# EasyEDA Pro project Striso_USB_hub.epro

# Schematic sch_usb 2.0（type c version）
Board Name: 02-Type C version; Create Date: 2024-06-10; Page Name: P1; Project Name: USB hub SL2.1A; Schematic Name: sch_usb 2.0（type c version）; Update Date: 2024-08-19; Company: Striso; Drawn: pierstitus; Page Size: A5; Part Number: JLCPCB-001; Reviewed: EasyEDA; Version: V0.1
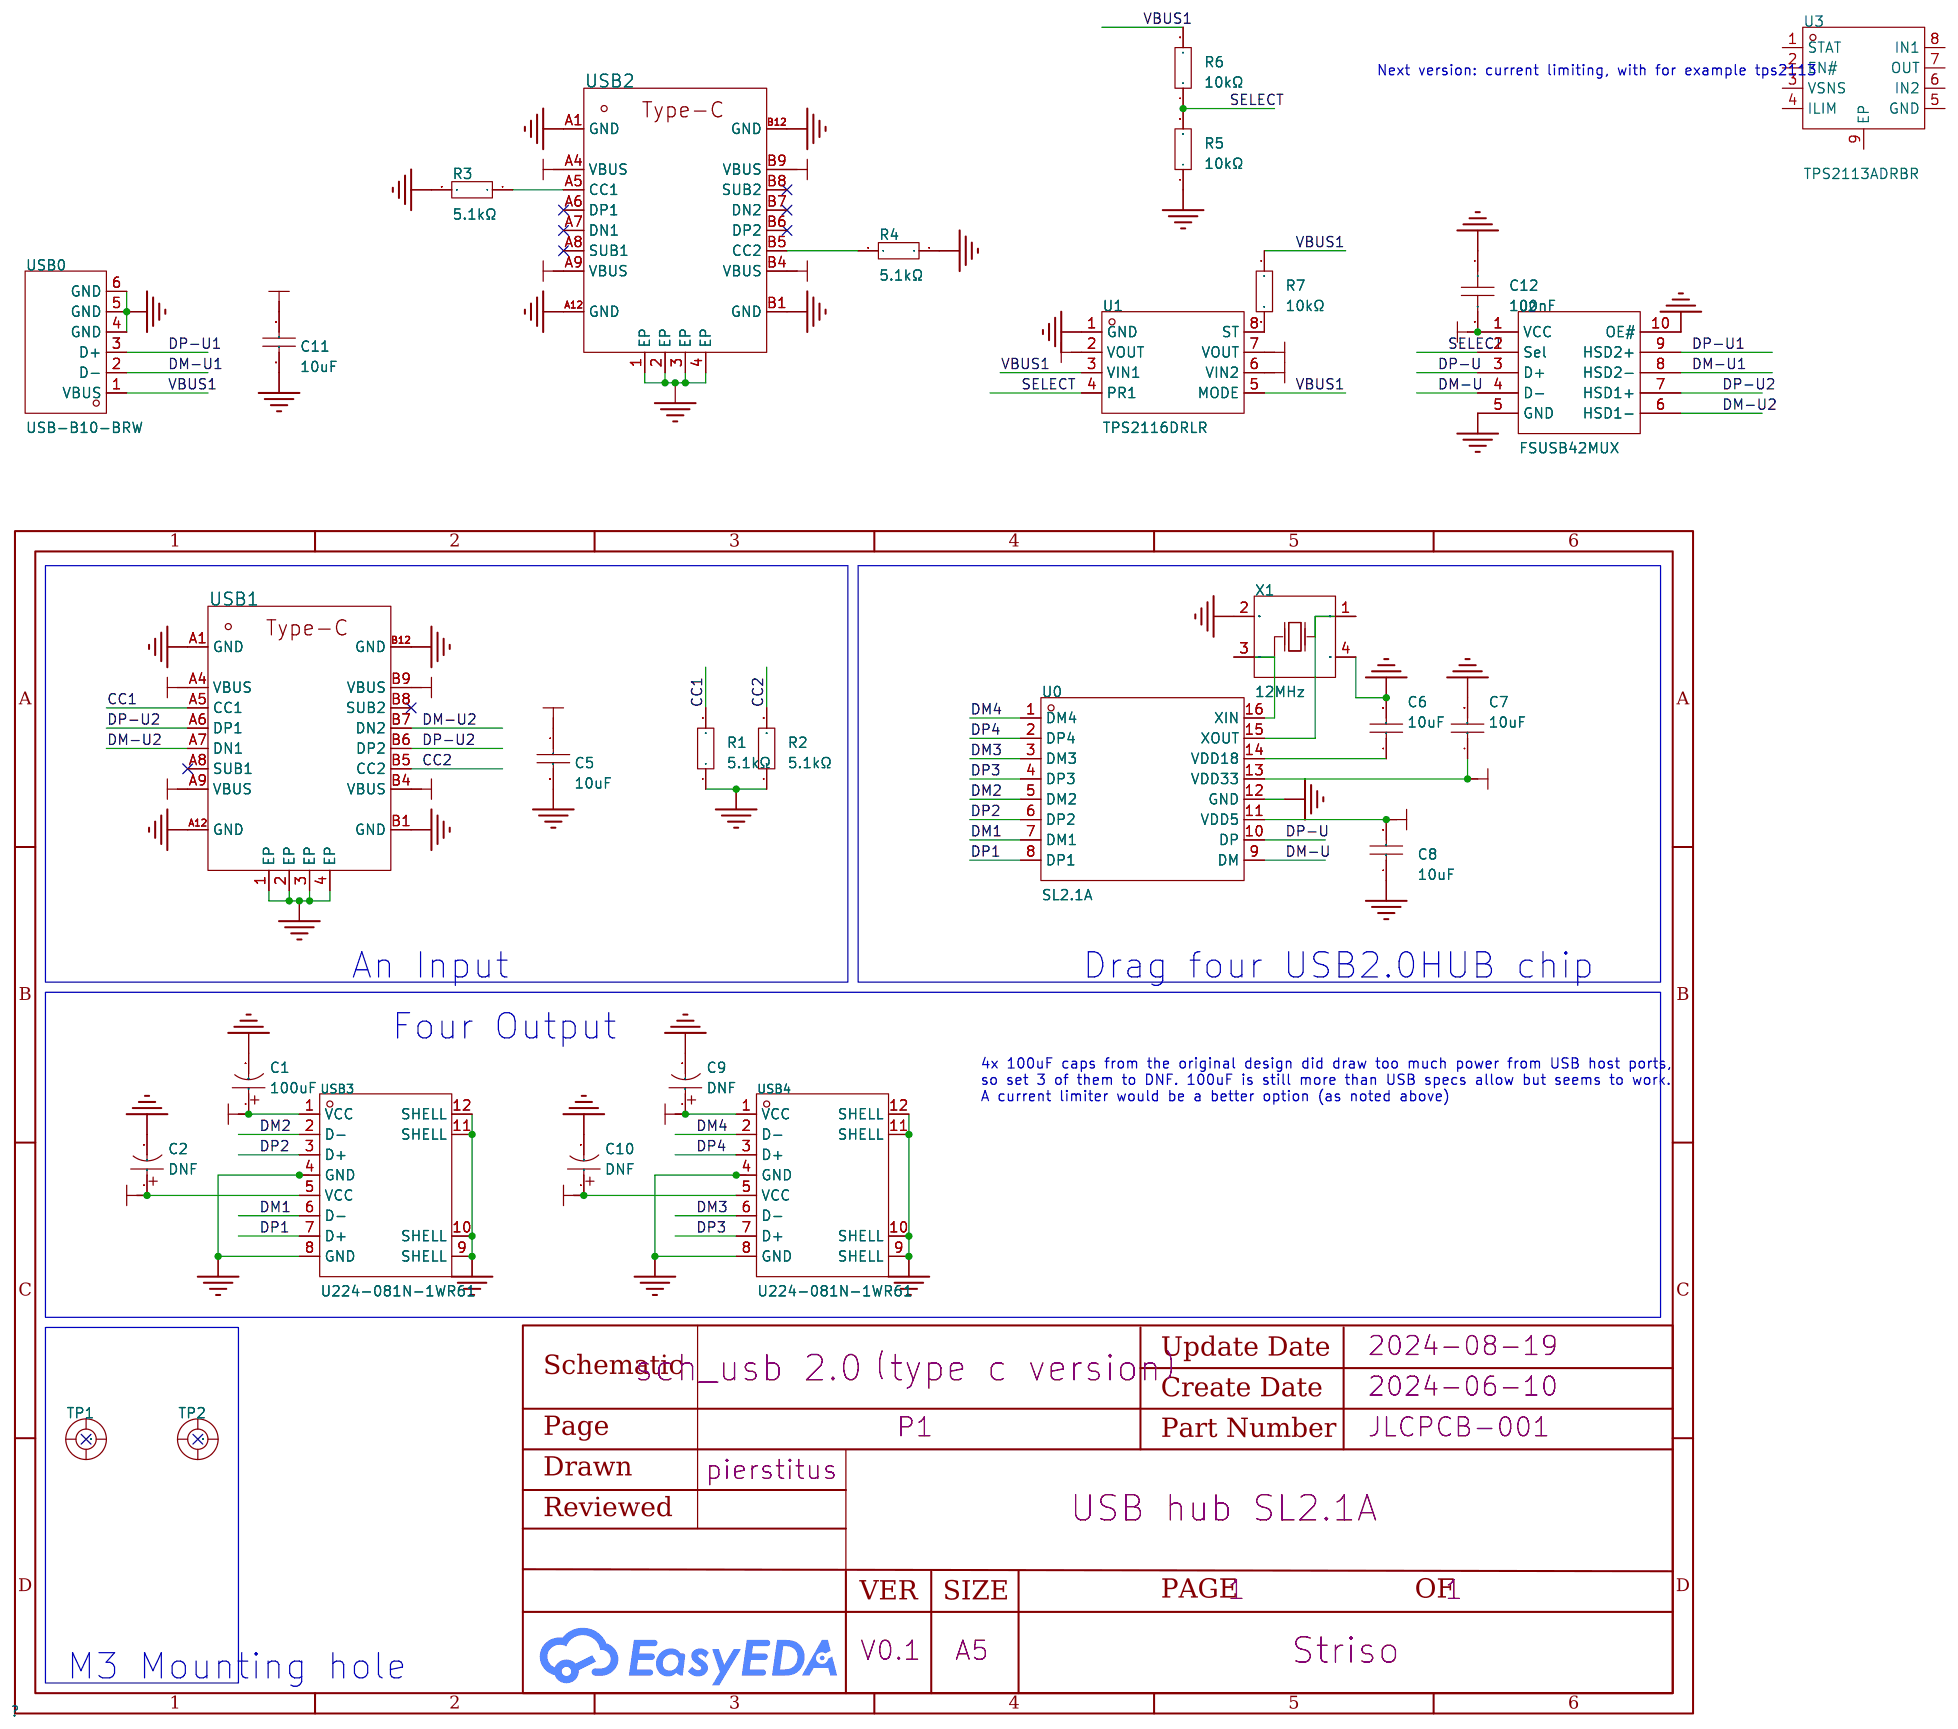
[diagram p0: schematic sheet]

## Parts
C1  100uF  [CAP-SMD_BD6.3-L6.6-W6.6-FD]
C2  DNF  [CAP-SMD_BD6.3-L6.6-W6.6-FD]
C5  10uF  [C0805]
C6  10uF  [C0805]
C7  10uF  [C0805]
C8  10uF  [C0805]
C9  DNF  [CAP-SMD_BD6.3-L6.6-W6.6-FD]
C10  DNF  [CAP-SMD_BD6.3-L6.6-W6.6-FD]
C11  10uF  [C0805]
C12  100nF  [C0603]
R1  5.1kΩ  [R0603]
R2  5.1kΩ  [R0603]
R3  5.1kΩ  [R0603]
R4  5.1kΩ  [R0603]
R5  10kΩ  [R0603]
R6  10kΩ  [R0603]
R7  10kΩ  [R0603]
TP1  -  [M3]
TP2  -  [M3]
U0  SL2.1A  [SOP-16_L10.0-W3.9-P1.27-LS6.0-BL]
U1  TPS2116DRLR  [SOT-583-8_L2.1-W1.6-P0.50-LS1.6-BL]
U2  FSUSB42MUX  [MSOP-10_L3.0-W3.0-P0.50-LS5.0-BL]
U3  TPS2113ADRBR  [SON-8_L3.0-W3.0-P0.65-LS3.0-BL-EP]
USB0  USB-B10-BRW  [USB-B-TH_USB-B10-BRW]
USB1  KH-TYPE-C-16P  [USB-C-SMD_KH-TYPE-C-16P]
USB2  KH-TYPE-C-16P  [USB-C-SMD_KH-TYPE-C-16P]
USB3  U224-081N-1WR61  [USB-A-TH_XKB_U224-08XN-1XR61]
USB4  U224-081N-1WR61  [USB-A-TH_XKB_U224-08XN-1XR61]
X1  12MHz  [OSC-SMD_4P-L3.2-W2.5-BL]

## Library data of the parts
C1 = UWX1C101MCL1GB: 容值:100uF;精度:±20%;额定电压:16V;纹波电流:129mA@10kHz;等效串联电阻:-;; LCSC Part Name: 100uF ±20% 16V; Supplier Part: C37308; Manufacturer: Nichicon(尼吉康); Supplier Footprint: SMD,D6.3xL5.5mm; JLCPCB Part Class: 扩展库; Datasheet: https://atta.szlcsc.com/upload/public/pdf/source/20170511/1494500117526.pdf; Supplier: LCSC; Tolerance: ±20%; Rated Voltage: 16V; φD: 6.3mm; L: 5.4mm; Ripple Current: 129mA@10kHz; Lifetime @ Temp: 2000hrs@85℃; Operating Temperature: -40℃~+85℃
C2 C9 C10 = UWX1C101MCL1GB: 容值:100uF;精度:±20%;额定电压:16V;纹波电流:129mA@10kHz;等效串联电阻:-;; LCSC Part Name: 100uF ±20% 16V; Supplier Part: C111600; Manufacturer: Nichicon(尼吉康); Supplier Footprint: SMD,D6.3xL5.5mm; JLCPCB Part Class: 扩展库; Datasheet: https://atta.szlcsc.com/upload/public/pdf/source/20170511/1494500117526.pdf; Supplier: LCSC; Tolerance: ±20%; Rated Voltage: 16V; φD: 6.3mm; L: 5.4mm; Ripple Current: 129mA@10kHz; Lifetime @ Temp: 2000hrs@85℃; Operating Temperature: -40℃~+85℃
C5-C8 C11 = CL21A106KAYNNNE_C15850: 容值:10uF;精度:±10%;额定电压:25V;材质(温度系数):X5R;; LCSC Part Name: 10uF ±10% 25V; Supplier Part: C15850; Manufacturer: SAMSUNG(三星); Manufacturer Part: CL21A106KAYNNNE; Supplier Footprint: 0805; Datasheet: https://atta.szlcsc.com/upload/public/pdf/source/20160103/1457707679302.pdf; Supplier: LCSC; Tolerance: ±10%; Voltage Rated: 25V; Temperature Coefficient: X5R
C12 = CAP_0603: Supplier Footprint: 0603
R1-R7 = Res_0603: Supplier Footprint: 0603
TP1 TP2 = M3: Manufacturer: Shuntian(顺天五金); Manufacturer Part: M3x10+6; Supplier Part: C551322; Supplier: LCSC; JLCPCB Part Class: 扩展库
U0 = SL2.1A: 应用功能:集线器;接口协议:-;; LCSC Part Name: SL2.1A USB2.0 HUB 控制器集成电路; Supplier Part: C192893; Manufacturer: CoreChips(和芯润德); Supplier Footprint: SOP-16; Datasheet: https://atta.szlcsc.com/upload/public/pdf/source/20180522/C192893_624110D24898D57AAC785E3DF98EA862.pdf; Supplier: LCSC; Applications Function: 集线器
U1 = TPS2116DRLR: Number of Outputs:1 Output Current:2.5A Input Voltage:1.6V~5.5V Input Voltage:1.6V~5.5V Resistor On-State:42mΩ Operating Temperature	-:-40℃~+105℃ Operating Temperature	-:-40℃~+105℃; Supplier Part: C3235557; Manufacturer: TI(德州仪器); Supplier Footprint: SOT-583; JLCPCB Part Class: Extended Part; Datasheet: https://www.ti.com/cn/lit/gpn/tps2116; Supplier: LCSC; Number of Outputs: 1; Output Current: 2.5A; Input Voltage: 1.6V~5.5V; Resistor On-State: 42mΩ; Operating Temperature	-: -40℃~+105℃
U2 = FSUSB42MUX: Supply Voltage:2.4V~4.4V Supply Voltage:2.4V~4.4V On-State Resistance (Max):6.5Ω; LCSC Part Name: 小功率，两端口，高速 USB2.0 (480Mbps) 开关; Supplier Part: C11355; Manufacturer: onsemi(安森美); Supplier Footprint: MSOP-10; JLCPCB Part Class: Extended Part; Datasheet: https://atta.szlcsc.com/upload/public/pdf/source/20130225/1457706594597.pdf; Supplier: LCSC; Supply Voltage: 2.4V~4.4V; On-State Resistance (Max): 6.5Ω
U3 = TPS2113ADRBR: Supply Voltage:2.8V~5.5V Supply Voltage:2.8V~5.5V Output Current:1.25A Operating Temperature:-40℃~+85℃ Operating Temperature:-40℃~+85℃; LCSC Part Name: Other Power Mgt, PFC; Supplier Part: C354512; Manufacturer: TI(德州仪器); Supplier Footprint: SON-8(3x3); JLCPCB Part Class: Extended Part; Datasheet: https://www.ti.com/cn/lit/gpn/tps2112a; Supplier: LCSC; Supply Voltage: 2.8V~5.5V; Output Current: 1.25A; Operating Temperature: -40℃~+85℃
USB0 = USB-B10-BRW: Connector Type:Type-B Standard:USB 2.0 Gender:Female Number of Ports:1 Number of Contacts:4P Mounting Style:Right-Angle Current Rating - Power (Max):1.5A Operating Temperature Range:-20℃~+70℃ Operating Temperature Range:-20℃~+70℃ Soldering Temperature(Max; LCSC Part Name: Type-B 母 弯插; Supplier Part: C720549; Manufacturer: XUNPU(讯普); Supplier Footprint: 插件; JLCPCB Part Class: Extended Part; Datasheet: https://atta.szlcsc.com/upload/public/pdf/source/20200812/C720549_53E9294752E2933874870440E626C579.pdf; Supplier: LCSC; Connector Type: Type-B; Standard: USB 2.0; Gender: Female; Number of Ports: 1; Number of Contacts: 4P; Mounting Style: Right-Angle; Current Rating - Power (Max): 1.5A; Operating Temperature Range: -20℃~+70℃; Soldering Temperature(Max): 260℃
USB1 USB2 = KH-TYPE-C-16P: Type-C母座 16PIN 立式四角贴板无压片; Supplier: LCSC; Supplier Part: C709357; Manufacturer: kinghelm(金航标); LCSC Part Name: Type-C母座
USB3 USB4 = U224-081N-1WR61: Connector Type:Type-A Standard:USB 2.0 Gender:Female Number of Ports:1 Number of Contacts:8P Mounting Style:Right-Angle Current Rating - Power (Max):1.5A Contact Material:Brass Contact Plating:Gold Operating Temperature Range:-40℃~+85℃ Operating Temperatu; LCSC Part Name: Type-A 母 弯插; Supplier Part: C2880657; Manufacturer: XKB Connectivity(中国星坤); Supplier Footprint: 插件; JLCPCB Part Class: Extended Part; Datasheet: https://atta.szlcsc.com/upload/public/pdf/source/20211011/F494ADC5FD1E44F95AF51E6AD715C4B9.pdf; Supplier: LCSC; Connector Type: Type-A; Standard: USB 2.0; Gender: Female; Number of Ports: 1; Number of Contacts: 8P; Mounting Style: Right-Angle; Current Rating - Power (Max): 1.5A; Contact Material: Brass; Contact Plating: Gold; Operating Temperature Range: -40℃~+85℃; Soldering Temperature(Max): 235℃
X1 = X322512MSB4SI: Crystal Type:贴片晶振 Frequency: Normal temperature Frequency Tolerance:±10ppm Normal temperature Frequency Tolerance:±10ppm External load capacitor: Frequency Stability(Full temperature range):±20ppm Frequency Stability(Full temperature range):±20ppm Operati; LCSC Part Name: 12MHz ±10ppm 20pF; Supplier Part: C9002; Manufacturer: YXC(扬兴晶振); Supplier Footprint: SMD3225-4P; JLCPCB Part Class: Basic Part; Datasheet: https://atta.szlcsc.com/upload/public/pdf/source/20240329/19D5F850207469550BEB00D7DFEDBC7A.pdf; Supplier: LCSC; Crystal Type: 贴片晶振; Normal temperature Frequency Tolerance: ±10ppm; Frequency Stability(Full temperature range): ±20ppm

## Nets
3.3V: C7.1 C12.2 U0.13(VDD33) U2.1(VCC)
GND: C1.2 C2.2 C5.2 C6.2 C7.2 C8.1 C9.2 C10.2 C11.2 C12.1 R1.1 R2.1 R3.2 R4.1 R5.1 U0.12(GND) U1.1(GND) U2.5(GND) U2.10(OE#) USB0.4(GND) USB0.5(GND) USB0.6(GND) USB1.1(EP) USB1.2(EP) USB1.3(EP) USB1.4(EP) USB1.A1(GND) USB1.A12(GND) USB1.B1(GND) USB1.B12(GND) USB2.1(EP) USB2.2(EP) USB2.3(EP) USB2.4(EP) USB2.A1(GND) USB2.A12(GND) USB2.B1(GND) USB2.B12(GND) USB3.4(GND) USB3.8(GND) USB3.9(SHELL) USB3.10(SHELL) USB3.11(SHELL) USB3.12(SHELL) USB4.4(GND) USB4.8(GND) USB4.9(SHELL) USB4.10(SHELL) USB4.11(SHELL) USB4.12(SHELL) X1.2(GND) X1.4(GND)
VBUS: C1.1 C2.1 C8.2 C9.1 C10.1 U0.11(VDD5) U1.2(VOUT) U1.7(VOUT) USB2.A4(VBUS) USB2.A9(VBUS) USB2.B4(VBUS) USB2.B9(VBUS) USB3.1(VCC) USB3.5(VCC) USB4.1(VCC) USB4.5(VCC)
VBUS1: C11.1 R6.2 R7.1 U1.3(VIN1) U1.5(MODE) USB0.1(VBUS)
VBUS2: C5.1 U1.6(VIN2) USB1.A4(VBUS) USB1.A9(VBUS) USB1.B4(VBUS) USB1.B9(VBUS)
CC1: R1.2 USB1.A5(CC1)
CC2: R2.2 USB1.B5(CC2)
DM1: U0.7(DM1) USB3.6(D-)
DM2: U0.5(DM2) USB3.2(D-)
DM3: U0.3(DM3) USB4.6(D-)
DM4: U0.1(DM4) USB4.2(D-)
DM-U: U0.9(DM) U2.4(D-)
DM-U1: U2.8(HSD2-) USB0.2(D-)
DM-U2: U2.6(HSD1-) USB1.A7(DN1) USB1.B7(DN2)
DP1: U0.8(DP1) USB3.7(D+)
DP2: U0.6(DP2) USB3.3(D+)
DP3: U0.4(DP3) USB4.7(D+)
DP4: U0.2(DP4) USB4.3(D+)
DP-U: U0.10(DP) U2.3(D+)
DP-U1: U2.9(HSD2+) USB0.3(D+)
DP-U2: U2.7(HSD1+) USB1.A6(DP1) USB1.B6(DP2)
SELECT: R5.2 R6.1 U1.4(PR1) U2.2(Sel)
$1N2405: C6.1 U0.14(VDD18)
$1N3683: U0.16(XIN) X1.3(OSC2)
$1N12703: R3.1 USB2.A5(CC1)
$1N12903: R4.2 USB2.B5(CC2)
$1N15987: R7.2 U1.8(ST)
$1N16304: U0.15(XOUT) X1.1(OSC1)

Not connected (* = marked no-connect by the designer): TP1 0*; TP2 0*; U3 1(STAT) 2(EN#) 3(VSNS) 4(ILIM) 5(GND) 6(IN2) 7(OUT) 8(IN1) 9(EP); USB1 A8(SUB1)* B8(SUB2)*; USB2 A6(DP1)* A7(DN1)* A8(SUB1)* B6(DP2)* B7(DN2)* B8(SUB2)*

## Notes on the sheet
- Next version: current limiting, with for example tps2113
- An Input
- Drag four USB2.0HUB chip
- Four Output
- 4x 100uF caps from the original design did draw too much power from USB host ports,
  so set 3 of them to DNF. 100uF is still more than USB specs allow but seems to work.
  A current limiter would be a better option (as noted above)
- M3 Mounting hole

# Board PCB_USB 2.0（Type C version）
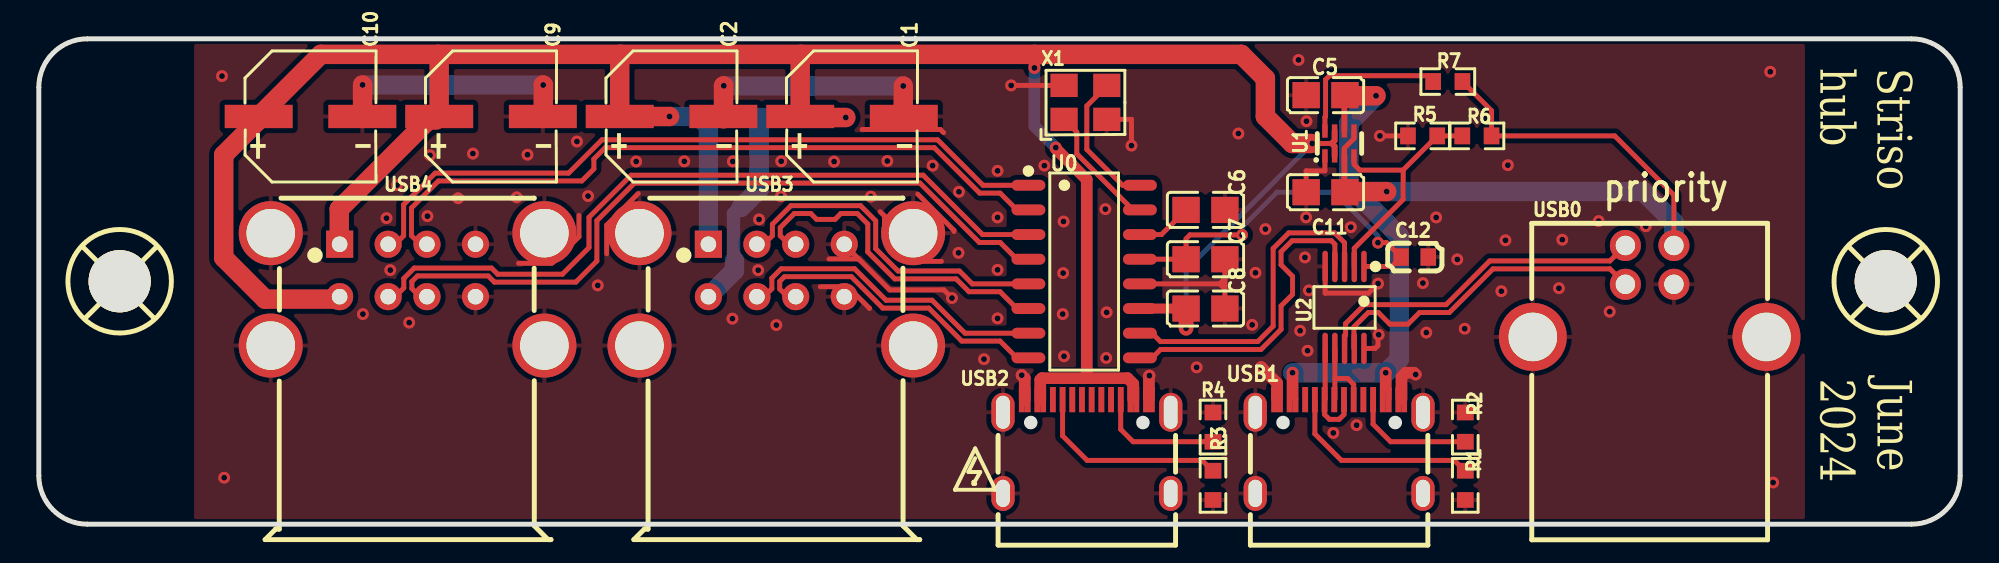
[diagram p1: board, top side]
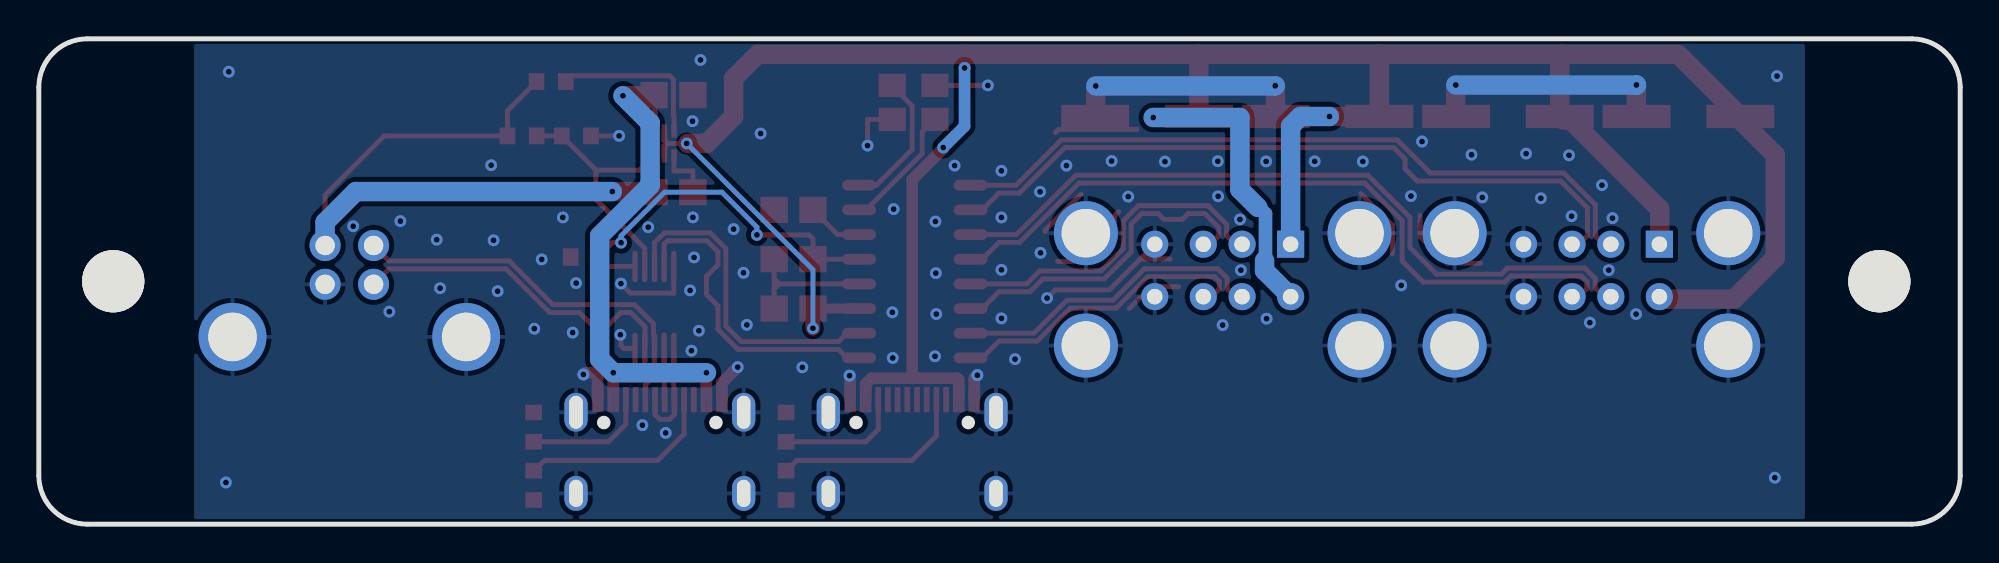
[diagram p2: board, bottom side, seen from below]

Outline 99 x 25 mm; copper layers: Top Layer, Bottom Layer. Coordinates in mm from the lower left corner of the outline.
Outline path: 0,22.5 0,2.5 arc(0.73,0.73) 2.5,0 96.5,0 arc(98.27,0.73) 99,2.5 99,22.5 arc(98.27,24.27) 96.5,25 2.5,25 arc(0.73,24.27) 0,22.5
Stack: Top Layer 0.035mm - / Dielectric1 1.51mm FR4 er 4.5 / Bottom Layer 0.035mm -

## Design rules (mm)
net DM4: OUTPUT4
net DP4: OUTPUT4
net DM1: OUTPUT1
net DP1: OUTPUT1
net DM2: OUTPUT2
net DP2: OUTPUT2
net DM3: OUTPUT3
net DP3: OUTPUT3
net DP-U: DP3
net DM-U: DP3
net DM-U2: DP1
net DP-U2: DP1
net DP-U1: DP2
net DM-U1: DP2
template: 自定义配置
spacing copperThickness1oz (default): track to track 0.152, other pairs 0.152 to 0.3
spacing copperThickness2oz: track to track 0.203, other pairs 0.152 to 0.3
track width copperThickness1oz (default): min 0.127, default 0.254, max 2.54
track width copperThickness2oz: min 0.203, default 0.254, max 2.54
differential pair differentialPair (default): width min 0.127, default 0.254, max 2.54; gap min 0.152, default 0.152
via viaSize (default): diameter min 0.5, default 0.61, max 10; hole min 0.3, default 0.305, max 6.299

## Placement (name value [footprint] x y rotation side)
C1  100uF  [CAP-SMD_BD6.3-L6.6-W6.6-FD]  41.9 21 0 top
C2  DNF  [CAP-SMD_BD6.3-L6.6-W6.6-FD]  32.6 21 0 top
C5  10uF  [C0805]  66.3 22.1 180 top
C6  10uF  [C0805]  60.11 16.19 0 top
C7  10uF  [C0805]  60.11 13.65 0 top
C8  10uF  [C0805]  60.11 11.11 180 top
C9  DNF  [CAP-SMD_BD6.3-L6.6-W6.6-FD]  23.3 21 0 top
C10  DNF  [CAP-SMD_BD6.3-L6.6-W6.6-FD]  14 21 0 top
C11  10uF  [C0805]  66.3 17.1 180 top
C12  100nF  [C0603]  70.89 13.76 180 top
R1  5.1kΩ  [R0603]  73.5 2 90 top
R2  5.1kΩ  [R0603]  73.5 5 270 top
R3  5.1kΩ  [R0603]  60.5 2 270 top
R4  5.1kΩ  [R0603]  60.5 5 270 top
R5  10kΩ  [R0603]  71.3 20 0 top
R6  10kΩ  [R0603]  74.1 20 0 top
R7  10kΩ  [R0603]  72.6 22.8 180 top
TP1  -  [M3]  4 12.5 0 top
TP2  -  [M3]  95 12.5 0 top
U0  SL2.1A  [SOP-16_L10.0-W3.9-P1.27-LS6.0-BL]  53.86 13.01 270 top
U1  TPS2116DRLR  [SOT-583-8_L2.1-W1.6-P0.50-LS1.6-BL]  67.02 19.61 0 top
U2  FSUSB42MUX  [MSOP-10_L3.0-W3.0-P0.50-LS5.0-BL]  67.28 11.16 180 top
USB0  USB-B10-BRW  [USB-B-TH_USB-B10-BRW]  83 12 0 top
USB1  KH-TYPE-C-16P  [USB-C-SMD_KH-TYPE-C-16P]  67 4 0 top
USB2  KH-TYPE-C-16P  [USB-C-SMD_KH-TYPE-C-16P]  54 4 0 top
USB3  U224-081N-1WR61  [USB-A-TH_XKB_U224-08XN-1XR61]  38 12.09 0 top
USB4  U224-081N-1WR61  [USB-A-TH_XKB_U224-08XN-1XR61]  19 12.09 0 top
X1  12MHz  [OSC-SMD_4P-L3.2-W2.5-BL]  53.93 21.73 0 top

## Footprints (pads in the part's own frame, mm; a bottom-side part is the same pattern mirrored in y, then rotated)
C0603
  rect 0.8x0.9 smd: 1(-0.7,0) 2(0.7,0)
C0805
  rect 1.41x1.35 smd: 1(-1,0) 2(1,0)
CAP-SMD_BD6.3-L6.6-W6.6-FD
  rect 3.5x1.2 smd: 1(-2.67,0) 2(2.67,0)
M3
  round 3.2 hole 3.2: 0(0.165,0.013)
MSOP-10_L3.0-W3.0-P0.50-LS5.0-BL
  oval 0.28x1.62 smd: 1(-1,-2.11) 2(-0.5,-2.11) 3(0,-2.11) 4(0.5,-2.11) 5(1,-2.11) 6(1,2.11) 7(0.5,2.11) 8(0,2.11) 9(-0.5,2.11) 10(-1,2.11)
OSC-SMD_4P-L3.2-W2.5-BL
  rect 1.4x1.2 smd: 1(-1.1,-0.875) 2(1.1,-0.875) 3(1.1,0.875) 4(-1.1,0.875)
R0603
  rect 0.806x0.864 smd: 1(-0.753,0) 2(0.753,0)
SOP-16_L10.0-W3.9-P1.27-LS6.0-BL
  oval 0.56x1.745 smd: 1(-4.445,-2.873) 2(-3.175,-2.873) 3(-1.905,-2.873) 4(-0.635,-2.873) 5(0.635,-2.873) 6(1.905,-2.873) 7(3.175,-2.873) 8(4.445,-2.873) 9(4.445,2.873) 10(3.175,2.873) 11(1.905,2.873) 12(0.635,2.873) 13(-0.635,2.873) 14(-1.905,2.873) 15(-3.175,2.873) 16(-4.445,2.873)
SOT-583-8_L2.1-W1.6-P0.50-LS1.6-BL
  rect 0.28x0.68 smd: 1(-0.75,-0.64) 2(-0.25,-0.64) 3(0.25,-0.64) 4(0.75,-0.64) 5(0.75,0.64) 6(0.25,0.64) 7(-0.25,0.64) 8(-0.75,0.64)
USB-A-TH_XKB_U224-08XN-1XR61
  rect 1.4x1.4 hole 0.8: 1(-3.5,2.325)
  round 1.4 hole 0.8: 2(-1,2.325) 3(1,2.325) 4(3.5,2.325) 5(-3.5,-0.375) 6(-1,-0.375) 7(1,-0.375) 8(3.5,-0.375)
  round 3.3 hole 2.5: 9(-7.05,2.895) 10(-7.05,-2.895) 11(7.05,2.895) 12(7.05,-2.895)
USB-B-TH_USB-B10-BRW
  round 1.6 hole 1: 1(1.25,2.355) 2(-1.25,2.355) 3(-1.25,0.355) 4(1.25,0.355)
  round 3.5 hole 2.5: 5(-6.02,-2.355) 6(6.02,-2.355)
USB-C-SMD_KH-TYPE-C-16P
  oval 1.2x2 hole 0.7x1.7: 1(-4.32,1.765) 2(4.32,1.765)
  oval 1.2x1.8 hole 0.7x1.4: 3(-4.32,-2.415) 4(4.32,-2.415)
  rect 0.3x1.3 smd: A1(-3.35,2.415) A4(-2.55,2.415) A5(-1.25,2.415) A6(-0.25,2.415) A7(0.25,2.415) A8(1.25,2.415) A9(2.55,2.415) A12(3.35,2.415) B1(3.05,2.415) B4(2.25,2.415) B5(1.75,2.415) B6(0.75,2.415) B7(-0.75,2.415) B8(-1.75,2.415) B9(-2.25,2.415) B12(-3.05,2.415)

## Nets
As in the schematic.

Pads without a net: TP1 0; TP2 0; USB1 A8 B8; USB2 A6 A7 A8 B6 B7 B8

## Via types
v1: diameter 0.61, hole 0.305, Top Layer to Bottom Layer, 100 vias

## Routing (per net, layer and track width the routed paths; a pad name or vN(x,y) marks a point on that pad's centre or on a via; arc(x,y) is an arc through that point)
3.3V: length 19.4
  Top Layer w0.254: v1(62,14.9) 59.31,14.9 59.11,14.7 C7.1 U0.13 ; U2.1 69.71,13.27 C12.2 69.45,14.5 v1(69,14.5)
  Bottom Layer w0.254: v1(62,14.9) 62,15.3 63.8,17.1 66.75,17.1 69,14.85 v1(69,14.5)
GND: length 83.4
  Top Layer w0.254: 61.11,12.65 61.11,12.11 ; 61.11,12.65 60.84,12.38 ; 61.11,12.65 C7.2 ; 61.11,12.11 60.84,12.38 ; 61.11,12.11 C8.1 ; v1(56.3,19.5) 56.3,20.85 X1.2 ; 46.51,13.54 45.35,13.54 45.33,13.51 ; 26.59,13.61 26.42,13.44 24.72,13.44 ; 41.5,14.4 43.84,12.07 46.63,12.07 v1(47.05,11.65) ; U1.1 66.27,18.2 65.3,18.2 C11.2 ; 45.29,17 47.15,15.14 47.15,15.07 ; 46.62,20.17 46.45,20.33 42.42,20.33 ; 60.84,12.38 U0.12 ; 30.89,17.03 29.26,15.41 29.26,13.93 ; 40.71,13.66 42.19,13.66 ; 40.27,12.23 41.69,12.23 41.7,12.24 ; v1(69.04,9.76) 69,9.72 69,9.2 68.85,9.05 U2.10 ; 26.51,13.48 27.83,14.81 27.83,15.9 ; U2.5 66.28,11.9 68.51,11.9 v1(69.01,12.39) ; 41.8,12.12 42.8,11.12 42.8,11.12 ; 43.58,15.05 43.58,15.87 43.35,16.1 ; R5.1 v1(69.1,20) ; v1(50.1,22.6) X1.4
  Top Layer w0.6: v1(57.22,7.65) 57.2,7.62 57.2,6.44 ; 50.8,6.4 50.8,7.52 v1(50.64,7.67) ; v1(70.94,7.71) 70.85,7.8 70.42,7.8 70.21,7.59 70.21,6.44 ; v1(62.99,8.09) 63.8,7.27 63.8,6.45
  Top Layer w1: 16.66,21.02 16.68,21.05 v1(16.68,22.63) ; 25.99,21 25.99,22.61 v1(25.99,22.62) ; v1(44.54,22.57) 44.54,21.02 44.56,21 ; v1(35.29,22.58) 35.28,22.57 35.28,20.88
  Bottom Layer w0.6: v1(57.22,7.65) 57.22,7.66 ; v1(70.94,7.71) 70.93,7.71 ; v1(50.64,7.67) 50.63,7.68
  Bottom Layer w1: v1(25.99,22.62) 16.69,22.62 16.68,22.61 v1(16.68,22.63) ; v1(35.29,22.58) 35.3,22.57 v1(44.54,22.57)
  vias: v1(9.44,23.08) v1(9.55,2.39) v1(16.7,10.82) v1(17.92,15.76) v1(18.11,13.09) v1(18.46,17.46) v1(19.08,10.38) v1(20.02,15.87) v1(20.16,19) v1(21.61,16.79) v1(22.37,19.09) v1(24.62,16.83) v1(25.18,19.03) v1(27.73,19.71) v1(28.3,16.9) v1(28.8,12.3) v1(30.78,18.68) v1(33.26,18.69) v1(35.74,10.59) v1(35.76,18.69) v1(37.11,15.7) v1(37.06,13.08) v1(38,10.26) v1(38.24,16.89) v1(38.25,18.7) v1(40.98,18.68) v1(42.87,16.87) v1(43.72,18.71) v1(46.05,18.47) v1(47.41,17.12) v1(47.39,13.98) v1(48.7,8.5) v1(49.4,18.2) v1(49.4,15.8) v1(49.4,13.1) v1(49.4,10.6) v1(51.81,18.47) v1(52.8,15.59) v1(52.78,12.93) v1(52.76,10.82) v1(52.82,8.65) v1(54.95,16.23) v1(55.02,10.91) v1(55,8.56) v1(59.66,8.08) v1(61.81,20.12) v1(62.52,10.27) v1(62.69,12.95) v1(63.2,15.2) v1(64.91,23.91) v1(64.99,9.96) v1(65.24,13.74) v1(65.32,20.76) v1(65.3,15.8) v1(65.44,12.04) v1(65.37,8.93) v1(66.7,4.7) v1(67.6,15.3) v1(67.9,5.1) v1(71.32,12.42) v1(71.49,9.87) v1(72,15.8) v1(73.09,13.64) v1(73.47,10.07) v1(75.36,12) v1(75.57,14.62) v1(75.69,18.49) v1(78.32,12.15) v1(78.5,14.65) v1(80.37,15.61) v1(80.94,10.95) v1(82.8,15.35) v1(89.21,23.3) v1(89.36,2.15)
VBUS: length 162.6
  Top Layer w0.254: 66.62,19.61 v1(65.62,19.61)
  Top Layer w0.3: U1.7 66.77,19.76 66.62,19.61 66.77,19.46 U1.2
  Top Layer w0.508: U0.11 C8.2
  Top Layer w0.6: v1(52.4,19.4) 52.4,19.34 54,17.75 54,7.52 ; 54,7.52 51.69,7.52 51.6,7.43 51.6,6.41 ; 54,7.52 56.1,7.52 56.39,7.23 56.39,6.41 ; 51.3,24.2 v1(51.3,23.5)
  Top Layer w0.762: v1(59.11,10.09) C8.2
  Top Layer w1: v1(32.5,21) C2.1 29.93,24.16 29.97,24.2 ; 15.44,11.59 11.66,11.59 9.53,13.72 9.53,19.02 11.44,20.93 ; v1(41.58,20.95) 39.28,20.95 39.22,21 ; 20.57,24.2 20.63,24.14 C9.1 ; 20.57,24.2 29.97,24.2 ; 20.57,24.2 14.53,24.2 C10.1 ; C1.1 39.23,24.16 39.27,24.2 ; 65.55,19.61 64.59,19.61 63.2,21 63.2,22.96 61.96,24.2 39.27,24.2 ; 29.97,24.2 39.27,24.2 ; 20.47,20.82 20.07,20.82 15.48,16.23 15.48,14.3
  Bottom Layer w0.254: v1(59.11,10.09) 59.11,13.11 v1(65.62,19.61)
  Bottom Layer w0.6: v1(51.3,23.5) 51.3,20.5 v1(52.4,19.4)
  Bottom Layer w0.7: 35.84,13.58 35.8,13.62 35.8,15.99 36.12,16.32 36.19,16.32
  Bottom Layer w1: USB3.5 35.84,13.06 35.84,13.58 ; 36.19,16.32 37.11,17.24 37.11,20.95 v1(41.58,20.95) ; USB3.1 34.5,20.5 34,21 v1(32.5,21)
VBUS1: length 38.9
  Top Layer w0.254: USB0.1 84.25,16.95 81.2,20 R6.2 74.85,21.3 R7.1 ; U1.5 67.77,19.87 67.27,19.37 U1.3
  Top Layer w0.3: U1.3 67.27,17.13 C11.1
  Top Layer w1: v1(69.45,17.13) 67.27,17.13
  Bottom Layer w1: v1(69.45,17.13) 82.67,17.13 84.25,15.55 USB0.1
VBUS2: length 27.4
  Top Layer w0.3: U1.6 67.27,22.07 C5.1 ; 69.4,7.1 69.55,6.95 USB1.A9 ; USB1.B9 64.6,6.56 64.6,7.1
  Top Layer w0.6: v1(69.4,7.8) 69.4,7.1 ; v1(64.6,7.8) 64.6,7.1
  Top Layer w1: 67.27,22.07 v1(68.9,22.07)
  Bottom Layer w1: v1(68.9,22.07) 67.5,20.67 67.5,17.45 70.1,14.85 70.1,8.5 v1(69.4,7.8) v1(64.6,7.8)
CC1: length 10.3
  Top Layer w0.254: USB1.A5 65.75,4.65 67.12,3.28 72.94,3.28 73.47,2.75 R1.2
CC2: length 6.4
  Top Layer w0.254: USB1.B5 68.75,5.15 69.65,4.25 R2.2
DM1: length 16.3
  Top Layer w0.254: USB3.6 37.36,11.72 37.77,12.13 37.77,12.67 38.25,13.15 42.03,13.15 43.65,11.54 46.03,11.54 47.72,9.84 U0.7
DM2: length 17.7
  Top Layer w0.254: USB3.2 37.36,14.42 37.8,14.86 37.8,15.45 38.75,16.41 42.34,16.41 43.12,15.63 43.12,14.19 44.27,13.04 47.44,13.04 48.1,12.38 U0.5
DM3: length 38.3
  Top Layer w0.254: USB4.6 18.36,11.72 18.81,12.17 18.81,12.65 19.34,13.19 23.33,13.19 23.64,12.88 26.98,12.88 28.35,14.25 28.35,15.81 30.52,17.98 45.57,17.98 48.63,14.92 U0.3
DM4: length 37.1
  Top Layer w0.254: USB4.2 18.36,14.42 18.8,14.86 18.8,16.46 20.42,18.08 27.3,18.08 29.01,19.8 46.31,19.8 48.65,17.46 U0.1
DM-U: length 16.6
  Top Layer w0.254: U2.4 66.78,14.42 66.6,14.6 64.57,14.6 64.01,14.03 64.01,13.36 64.6,12.77 64.6,11.84 64.01,11.24 64.01,10.03 62.97,9 57.8,9 57.37,8.57 U0.9
DM-U1: length 17.4
  Top Layer w0.254: USB0.2 80.95,13.56 74.76,13.56 72.51,11.31 68.31,11.31 67.33,10.33 67.33,9.73 67.28,9.68 U2.8
DM-U2: length 5.4
  Top Layer w0.254: USB1.A7 67.25,5.65 67,5.4 66.5,5.4 66.25,5.65 USB1.B7 66.28,6.44 U2.6
DP1: length 16
  Top Layer w0.254: U0.8 50.39,8.57 49.53,9.43 47.56,9.43 45.86,11.13 43.49,11.13 41.87,12.75 38.42,12.75 38.18,12.51 38.18,12.11 38.57,11.72 USB3.7
DP2: length 17.6
  Top Layer w0.254: U0.6 50.39,11.11 49.53,11.97 47.93,11.97 47.27,12.63 44.1,12.63 42.71,14.02 42.71,15.46 42.17,16 41.32,16 41.02,15.7 40.08,15.7 39.78,16 38.92,16 38.2,15.28 38.2,14.86 38.64,14.42 USB3.3
DP3: length 38.3
  Top Layer w0.254: U0.4 50.39,13.65 49.53,14.51 48.46,14.51 45.4,17.57 30.69,17.57 28.75,15.64 28.75,13.55 27.67,12.47 23.47,12.47 23.16,12.79 19.51,12.79 19.22,12.5 19.22,12.14 19.64,11.72 USB4.7
DP4: length 37.1
  Top Layer w0.254: USB4.3 19.64,14.42 19.2,14.86 19.2,16.29 20.59,17.68 27.98,17.68 28.6,18.3 28.6,18.81 29.18,19.39 46.14,19.39 48.48,17.05 49.53,17.05 50.39,16.19 U0.2
DP-U: length 16.8
  Top Layer w0.254: U2.3 67.28,14.5 66.77,15.01 64.41,15.01 63.6,14.2 63.6,10.2 62.81,9.41 57.79,9.41 57.36,9.84 U0.10
DP-U1: length 17.2
  Top Layer w0.254: U2.9 67.76,9.07 67.76,10.16 68.5,10.9 69.02,10.9 69.62,10.3 70.54,10.3 71.14,10.9 72.68,10.9 74.93,13.15 80.95,13.15 USB0.3
DP-U2: length 4.5
  Top Layer w0.254: U2.7 66.78,7.5 ; 66.78,7.5 67.44,7.5 67.75,7.19 USB1.B6 ; 66.78,7.5 66.78,6.44 USB1.A6
SELECT: length 12.9
  Top Layer w0.254: 70.29,18.24 70.3,18.24 70.3,16.73 67.78,14.21 U2.2 ; 70.29,18.24 R5.2 R6.1 ; 70.29,18.24 68.06,18.24 67.77,18.53 U1.4
$1N2405: length 2.9
  Top Layer w0.254: U0.14 57.84,14.92 C6.1
$1N3683: length 7.2
  Top Layer w0.254: U0.16 55.84,17.46 54,19.3 54,21.55 55.03,22.57 X1.3
$1N12703: length 10.4
  Top Layer w0.254: USB2.A5 52.75,4.55 54.02,3.28 59.94,3.28 60.47,2.75 R3.1
$1N12903: length 6.5
  Top Layer w0.254: R4.2 56.38,4.25 55.74,4.89 55.74,6.4
$1N15987: length 8.4
  Top Layer w0.254: U1.8 66.27,20.97 66.3,21 66.3,22.9 66.5,23.1 71.55,23.1 R7.2
$1N16304: length 6.5
  Top Layer w0.254: U0.15 56.38,16.19 53.48,19.08 53.48,20.2 X1.1

## Copper pours and planes (outline as drawn; the poured copper is in the pictures)
GND on Top Layer: 8,25 91,25 91,0 8,0
GND on Bottom Layer: 8,25 91,25 91,0 8,0

## Text on the board
Top Silkscreen Layer: priority | ⚡ | Striso / hub | June / 2024
